# EAGLE design PDM (EAGLE 7.7.0)
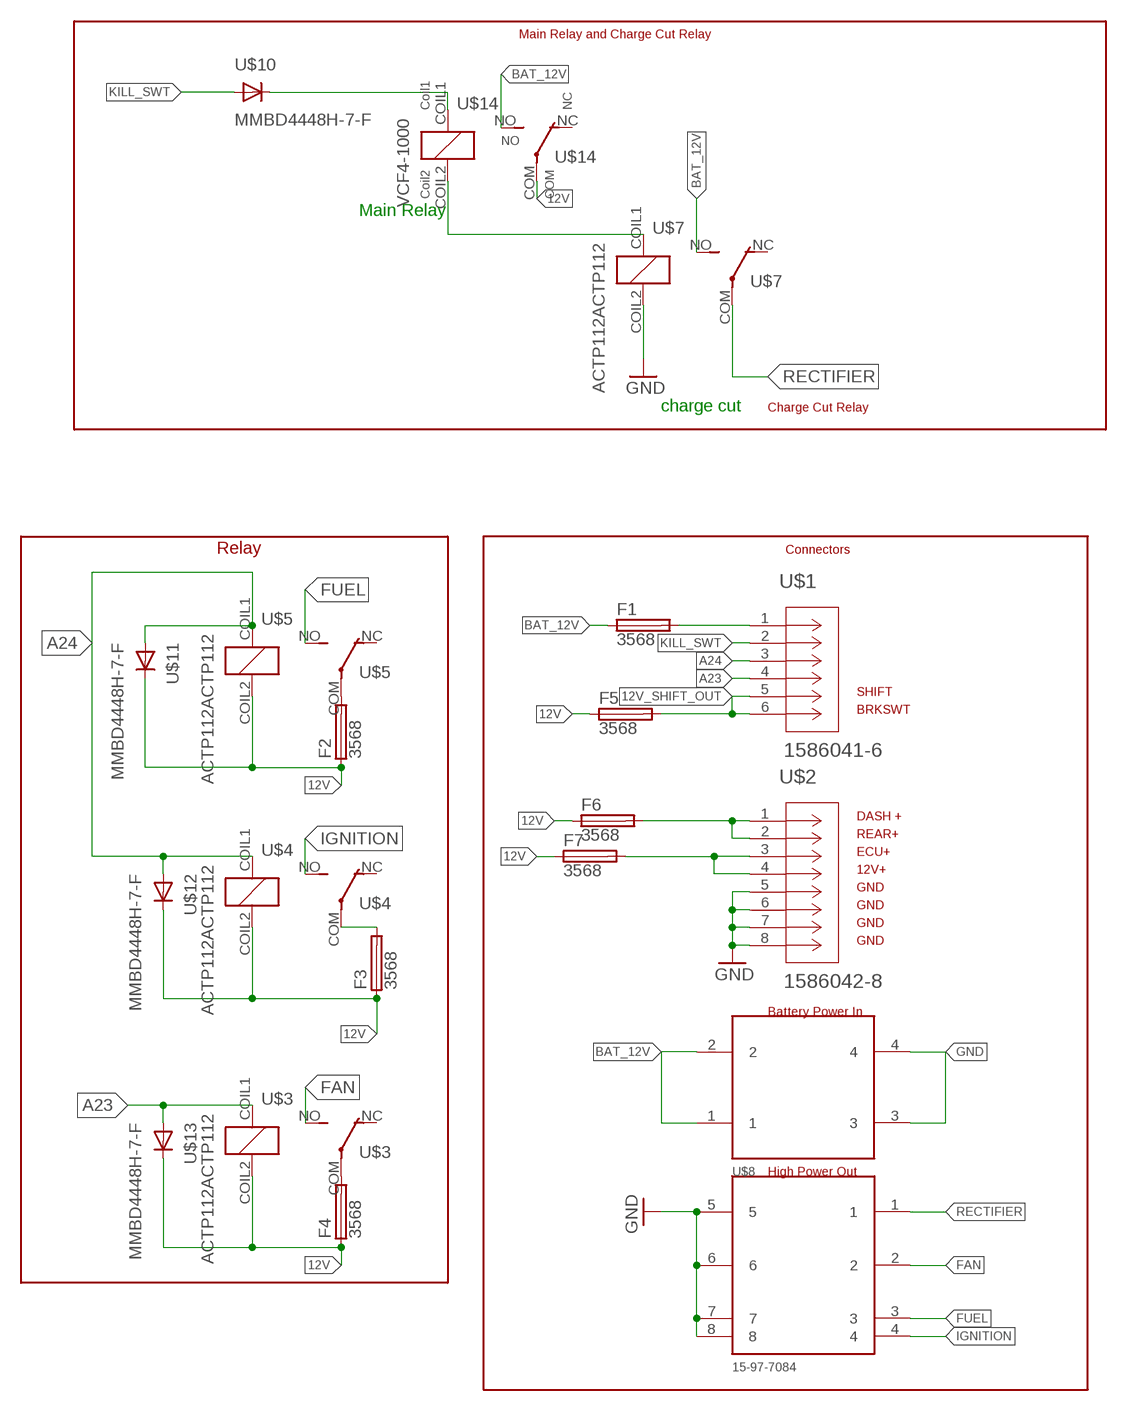
[diagram p0: schematic, sheet 1]

## Parts
F1  3568  [3568]
F2  3568  [3568]
F3  3568  [3568]
F4  3568  [3568]
F5  3568  [3568]
F6  3568  [3568]
F7  3568  [3568]
U$1  1586041-6  [1586041-6]
U$2  1586042-8  [1586042-8]
U$3  ACTP112ACTP112  [ACTP112]
U$4  ACTP112ACTP112  [ACTP112]
U$5  ACTP112ACTP112  [ACTP112]
U$7  ACTP112ACTP112  [ACTP112]
U$8  15-97-7084  [15-97-7084]
U$9  15-97-8043  [15-97-8043]
U$10  MMBD4448H-7-F  [SOT23-3]
U$11  MMBD4448H-7-F  [SOT23-3]
U$12  MMBD4448H-7-F  [SOT23-3]
U$13  MMBD4448H-7-F  [SOT23-3]
U$14  VCF4-1000  [VCF4-1000]

## Nets
12V: F2.1 F2.2 F3.1 F3.2 F4.1 F4.2 F5.1 F5.2 F6.1 F6.2 F7.1 F7.2 U$3.COIL2 U$4.COIL2 U$5.COIL2 U$11.3(C) U$12.3(C) U$13.3(C) U$14.COM
12V_DAQ_OUT: F6.3 F6.4 U$2.1 U$2.2
12V_FUSED_ECU: F7.3 F7.4 U$2.3 U$2.4
12V_SHIFT_OUT: F5.3 F5.4 U$1.5 U$1.6
A23: U$1.4 U$3.COIL1 U$13.1(A)
A24: U$1.3 U$4.COIL1 U$5.COIL1 U$11.1(A) U$12.1(A)
BAT_12V: F1.1 F1.2 U$7.NO U$9.1 U$9.2 U$14.NO
BAT_+12_FUSED: F1.3 F1.4 U$1.1
CHARGE_SIG: U$7.COIL1 U$14.COIL2
FAN: U$3.NO U$8.2
FAN_12V: F4.3 F4.4 U$3.COM
FUEL: U$5.NO U$8.3
FUEL_12V: F2.3 F2.4 U$5.COM
GND: U$2.5 U$2.6 U$2.7 U$2.8 U$7.COIL2 U$8.5 U$8.6 U$8.7 U$8.8 U$9.3 U$9.4
IGN_12V: F3.3 F3.4 U$4.COM
IGNITION: U$4.NO U$8.4
KILL_SWITCH_DIODE: U$10.3(C) U$14.COIL1
KILL_SWT: U$1.2 U$10.1(A)
RECTIFIER: U$7.COM U$8.1
Unconnected: U$3.NC U$4.NC U$5.NC U$7.NC U$14.NC

## Notes on the sheet
- Main Relay and Charge Cut Relay
- Main Relay
- charge cut | Charge Cut Relay
- Relay | Connectors
- SHIFT
- BRKSWT
- DASH +
- REAR+
- ECU+
- 12V+
- GND
- GND
- GND
- GND
- Battery Power In
- High Power Out

## Library data of the parts
F1-F7 = Keystone:3568: Mini ATC Fuse Holder 20A 500V 1 Circuit Blade PCB
U$1 = BMS Lbr:1586041-6: TE VAL-U-LOK TPA 6 Pin Header
U$2 = BMS Lbr:1586042-8: 1586042-8 8 pin Val-U-Lock TPA
U$3-U$5 U$7 = panasonic:ACTP112: ACTP112 Through-Hole Micro Relay
U$8 = molex:15-97-7084
U$9 = molex:15-97-8043
U$10-U$13 = diodes-inc:MMBD4448H-7-F
U$14 = relay:VCF4-1000

## Board
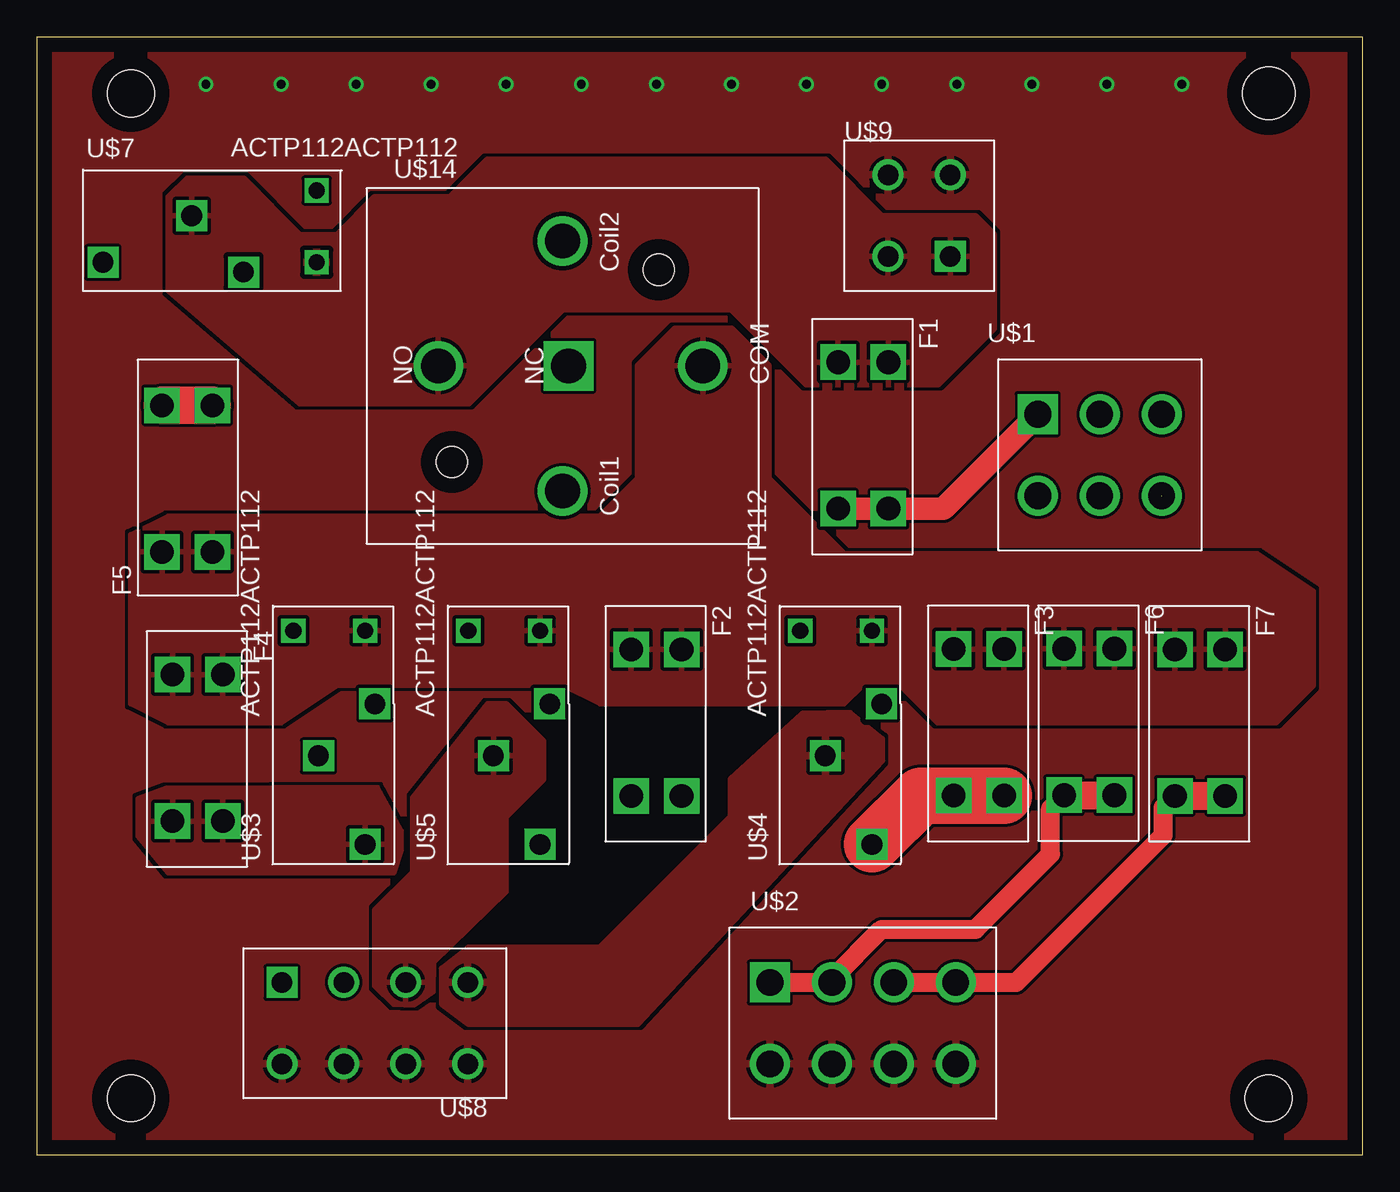
[diagram p1: board, top side]
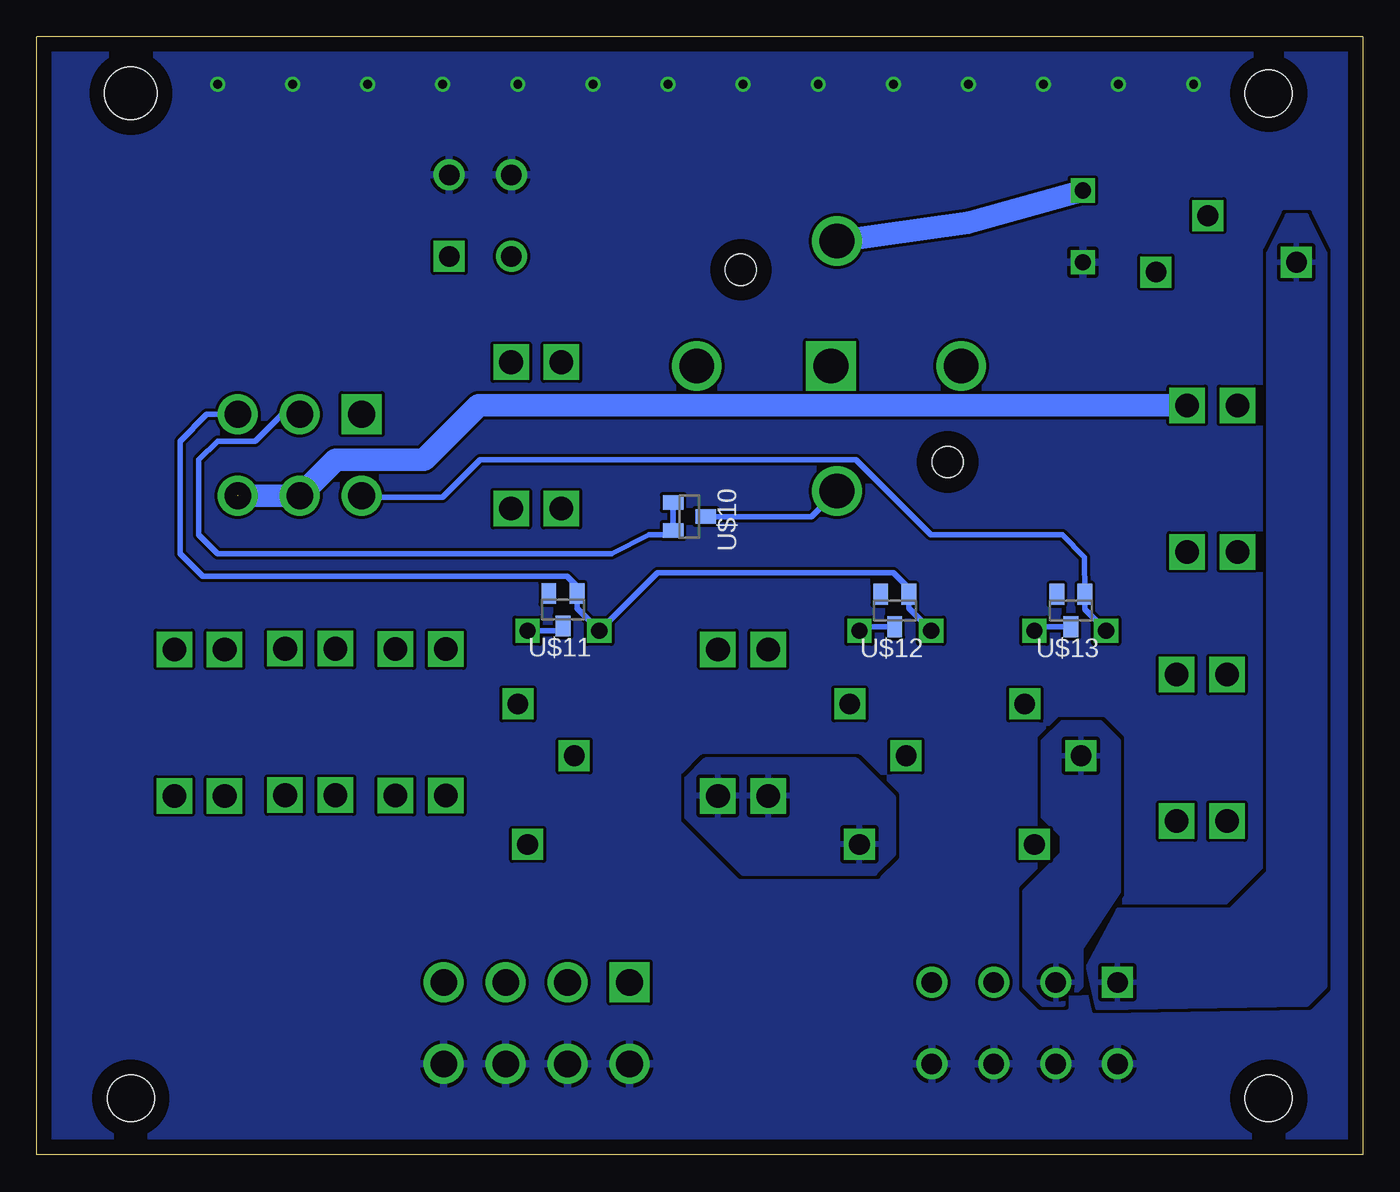
[diagram p2: board, bottom side, seen from below]

Size 89.69 x 75.59 mm. Coordinates in mm from the lower left corner, seen from the top.
Outline: 0,0 89.69,0 89.69,75.59 0,75.59 0,0
Copper layers (1*16): Top 0.035mm / dielectric 1.5mm / Bottom 0.035mm
Design rules "default": minimum track width 10mil, minimum drill 24mil, track to track 8mil, track to pad 8mil, pad to pad 8mil, via to via 8mil, smd to smd 8mil, copper to edge 40mil, drill to drill 8mil, minimum pad ring 10mil, minimum via ring 8mil, stop-mask expansion 4mil, vias tented up to drill 0mil, thermal gap 10mil
Holes 3.17 mm at 6.35,3.81 83.34,3.81 6.35,71.78
Holes 3.56 mm at 83.34,71.78

### Footprints (pad centres in the part's own frame; a part is rotated, then mirrored left to right if it is on the bottom)
3568 = drill 1.6 square: 1 -4.953,1.702; 2 -4.953,-1.702; 3 4.953,1.702; 4 4.953,-1.702
1586041-6 = drill 1.803 square: 1 -4.191,2.756 | drill 1.803: 2 0,2.756; 3 4.191,2.756; 4 -4.191,-2.756; 5 0,-2.756; 6 4.191,-2.756
1586042-8 = drill 1.803 square: 1 -6.287,2.756 | drill 1.803: 2 -2.095,2.756; 3 2.095,2.756; 4 6.287,2.756; 5 -6.287,-2.756; 6 -2.095,-2.756; 7 2.095,-2.756; 8 6.287,-2.756
ACTP112 = drill 1.092 square: COIL1 4.953,5.512; COIL2 4.953,0.66 | drill 1.397 square: COM -9.5,0.66; NC 0,0; NO -3.505,3.81
15-97-7084 = drill 1.397 square: 1 6.287,-2.756 | drill 1.397: 2 2.095,-2.756; 3 -2.095,-2.756; 4 -6.287,-2.756; 5 6.287,2.756; 6 2.095,2.756; 7 -2.095,2.756; 8 -6.287,2.756
15-97-8043 = drill 1.397 pad 1.803 square: 1 2.101,-2.756 | drill 1.397 pad 1.803: 2 -2.101,-2.756; 4 -2.101,2.756 | drill 1.397 pad 1.829: 3 2.101,2.756
SOT23-3 = smd 1 x 1.4: 1 -0.95,-1.1; 2 0.95,-1.1; 3 0,1.1
VCF4-1000 = drill 2.337: COIL1 0,-8.445; COIL2 0,8.445; COM 9.5,0; NO -8.407,0 | drill 2.337 square: NC 0.406,0 | hole 2.108: -7.493,-6.502; 6.502,6.502

### Placement (x,y rotation side)
F1  55.91,48.64 270 top
F2  41.91,29.21 270 top
F3  63.73,29.24 270 top
F4  10.87,27.51 270 top
F5  10.16,45.72 90 top
F6  71.2,29.26 270 top
F7  78.69,29.21 270 top
U$1  71.91,47.32 0 top
U$2  55.88,8.89 0 top
U$3  22.86,30.48 90 top
U$4  57.15,30.48 90 top
U$5  34.7,30.48 90 top
U$7  13.97,59.69 0 top
U$8  22.86,8.89 180 top
U$9  59.69,63.5 0 top
U$10  45.54,43.15 270 bottom
U$11  54.1,36.86 180 bottom
U$12  31.65,36.8 180 bottom
U$13  19.74,36.8 180 bottom
U$14  35.56,53.34 0 top

### Tracks (layer width: path | path; a pad name or v marks a point on that pad's centre or on a via)
12V
  Bottom 0.381: 22.2,35.87 U$3.COIL2 21.93,35.7 U$13.3 | U$11.3 54.42,35.43 U$4.COIL2 | U$12.3 33.76,35.7 U$5.COIL2
  pour Top (isolate 0.254): 38.1,43.18 8.89,43.18 6.35,41.91 6.35,30.48 8.89,29.21 16.51,29.21 20.32,31.75 35.56,31.75 38.1,30.48 54.61,30.48 55.88,31.75 58.42,31.75 60.96,29.21 83.82,29.21 86.36,31.75 86.36,38.1 82.55,40.64 54.61,40.64 49.53,45.72 49.53,53.34 46.99,55.88 43.18,55.88 40.64,53.34 40.64,45.72
12V_DAQ_OUT
  Top 1.27: U$2.1 U$2.2 53.78,11.87 57.15,15.24 63.5,15.24 68.58,20.32 68.58,23.39 F6.4
  Top 1.905: F6.4 F6.3
12V_FUSED_ECU
  Top 1.27: U$2.3 U$2.4 66.26,11.65 76.2,21.59 76.2,23.47 F7.4
  Top 1.905: F7.4 F7.3
12V_SHIFT_OUT  (1 unrouted)
  Top 2.54: F5.4 F5.3
  Bottom 1.524: F5.4 59.82,50.67 63.5,46.99 69.48,46.99 U$1.5 76.09,44.56 76.2,44.45
A23
  Bottom 0.381: 67.83,44.45 62.23,44.45 59.69,46.99 34.29,46.99 29.21,41.91 20.32,41.91 18.81,40.4 U$13.1 18.79,36.87 U$3.COIL1 | 68.58,44.45 67.83,44.45 | 67.83,44.45 U$1.4
A24
  Bottom 0.381: U$1.3 78.19,50.08 80.01,48.26 80.01,40.64 78.49,39.12 53.82,39.12 53.15,38.45 U$11.1 53.15,36.95 U$4.COIL1 47.7,39.37 31.75,39.37 30.7,38.32 U$12.1 30.7,36.95 U$5.COIL1
BAT_12V
  pour Top (isolate 0.305): 8.89,64.77 10.16,66.04 13.97,66.04 17.78,62.23 20.32,62.23 22.86,64.77 27.94,64.77 30.48,67.31 53.34,67.31 57.15,63.5 63.5,63.5 64.77,62.23 64.77,55.88 60.96,52.07 52.07,52.07 46.99,57.15 35.56,57.15 29.21,50.8 17.78,50.8 8.89,58.42
BAT_+12_FUSED
  Top 1.524: F1.4 F1.3 61.33,43.69 U$1.1
CHARGE_SIG
  Bottom 1.524: U$7.COIL1 26.7,63.02 U$14.COIL2
FAN
  pour Bottom: 16.51,27.94 17.78,29.21 20.32,29.21 21.59,27.94 21.59,22.86 20.32,21.59 20.32,20.32 22.86,17.78 22.86,11.43 21.59,10.16 20.32,10.16 19.05,11.43 19.05,13.97 16.51,17.78
FAN_12V
  pour Top: 8.79,24.79 6.86,24.08 6.86,21.54 8.89,19.05 24.13,19.05 24.64,20.62 24.64,21.89 23.01,24.84
FUEL
  pour Top: 22.86,11.43 24.13,10.16 25.48,10.11 26.8,11.02 26.85,13 31.75,17.78 31.75,22.86 34.29,25.4 34.29,27.94 31.75,30.48 30.48,30.48 25.4,24.13 25.4,19.05 22.86,16.51
FUEL_12V
  pour Bottom: 33.02,19.05 31.75,20.32 31.75,24.13 34.29,26.67 44.45,26.67 45.72,25.4 45.72,22.86 41.91,19.05
GND  (via drill 0.6)
  other vias: 11.43,72.39 16.51,72.39 21.59,72.39 26.67,72.39 31.75,72.39 36.83,72.39 41.91,72.39 46.99,72.39 52.07,72.39 57.15,72.39 62.23,72.39 67.31,72.39 72.39,72.39 77.47,72.39
  pour Top (rank 2): -1.02,76.76 90.17,76.2 91.44,-1.27 -1.27,-1.27
  pour Bottom (rank 3): -1.27,77.47 91.44,77.47 90.17,-1.27 -1.27,-1.27
IGN_12V
  Top 3.81: U$4.COM 59.79,24.28 F3.4 F3.3
IGNITION
  pour Top (isolate 0.381): 27.43,12.57 27.43,10.21 29.21,8.89 40.64,8.89 57.15,26.67 57.15,28.09 54.97,29.84 51.84,29.79 46.99,25.4 46.99,22.86 38.1,13.97 29.21,13.97
KILL_SWITCH_DIODE
  Bottom 0.381: U$10.3 37.3,43.16 U$14.COIL1
KILL_SWT
  Bottom 0.381: U$1.2 71.91,50.01 73.18,50.01 74.93,48.26 77.47,48.26 78.74,46.99 78.74,41.91 77.47,40.64 50.8,40.64 48.26,41.91 46.94,41.91 46.64,42.2 U$10.1
RECTIFIER
  pour Bottom (isolate 0.254): 3.81,63.5 2.54,60.96 2.54,11.43 3.81,10.16 17.91,9.93 18.57,12.75 16.51,16.51 8.89,16.51 6.35,19.05 6.35,60.96 5.08,63.5